# EasyEDA schematic loubar circuit.json
TITLE: Sheet_1; REV: 1.0; Date: 2024-02-27; Sheet: 1/1; Company: Your Company
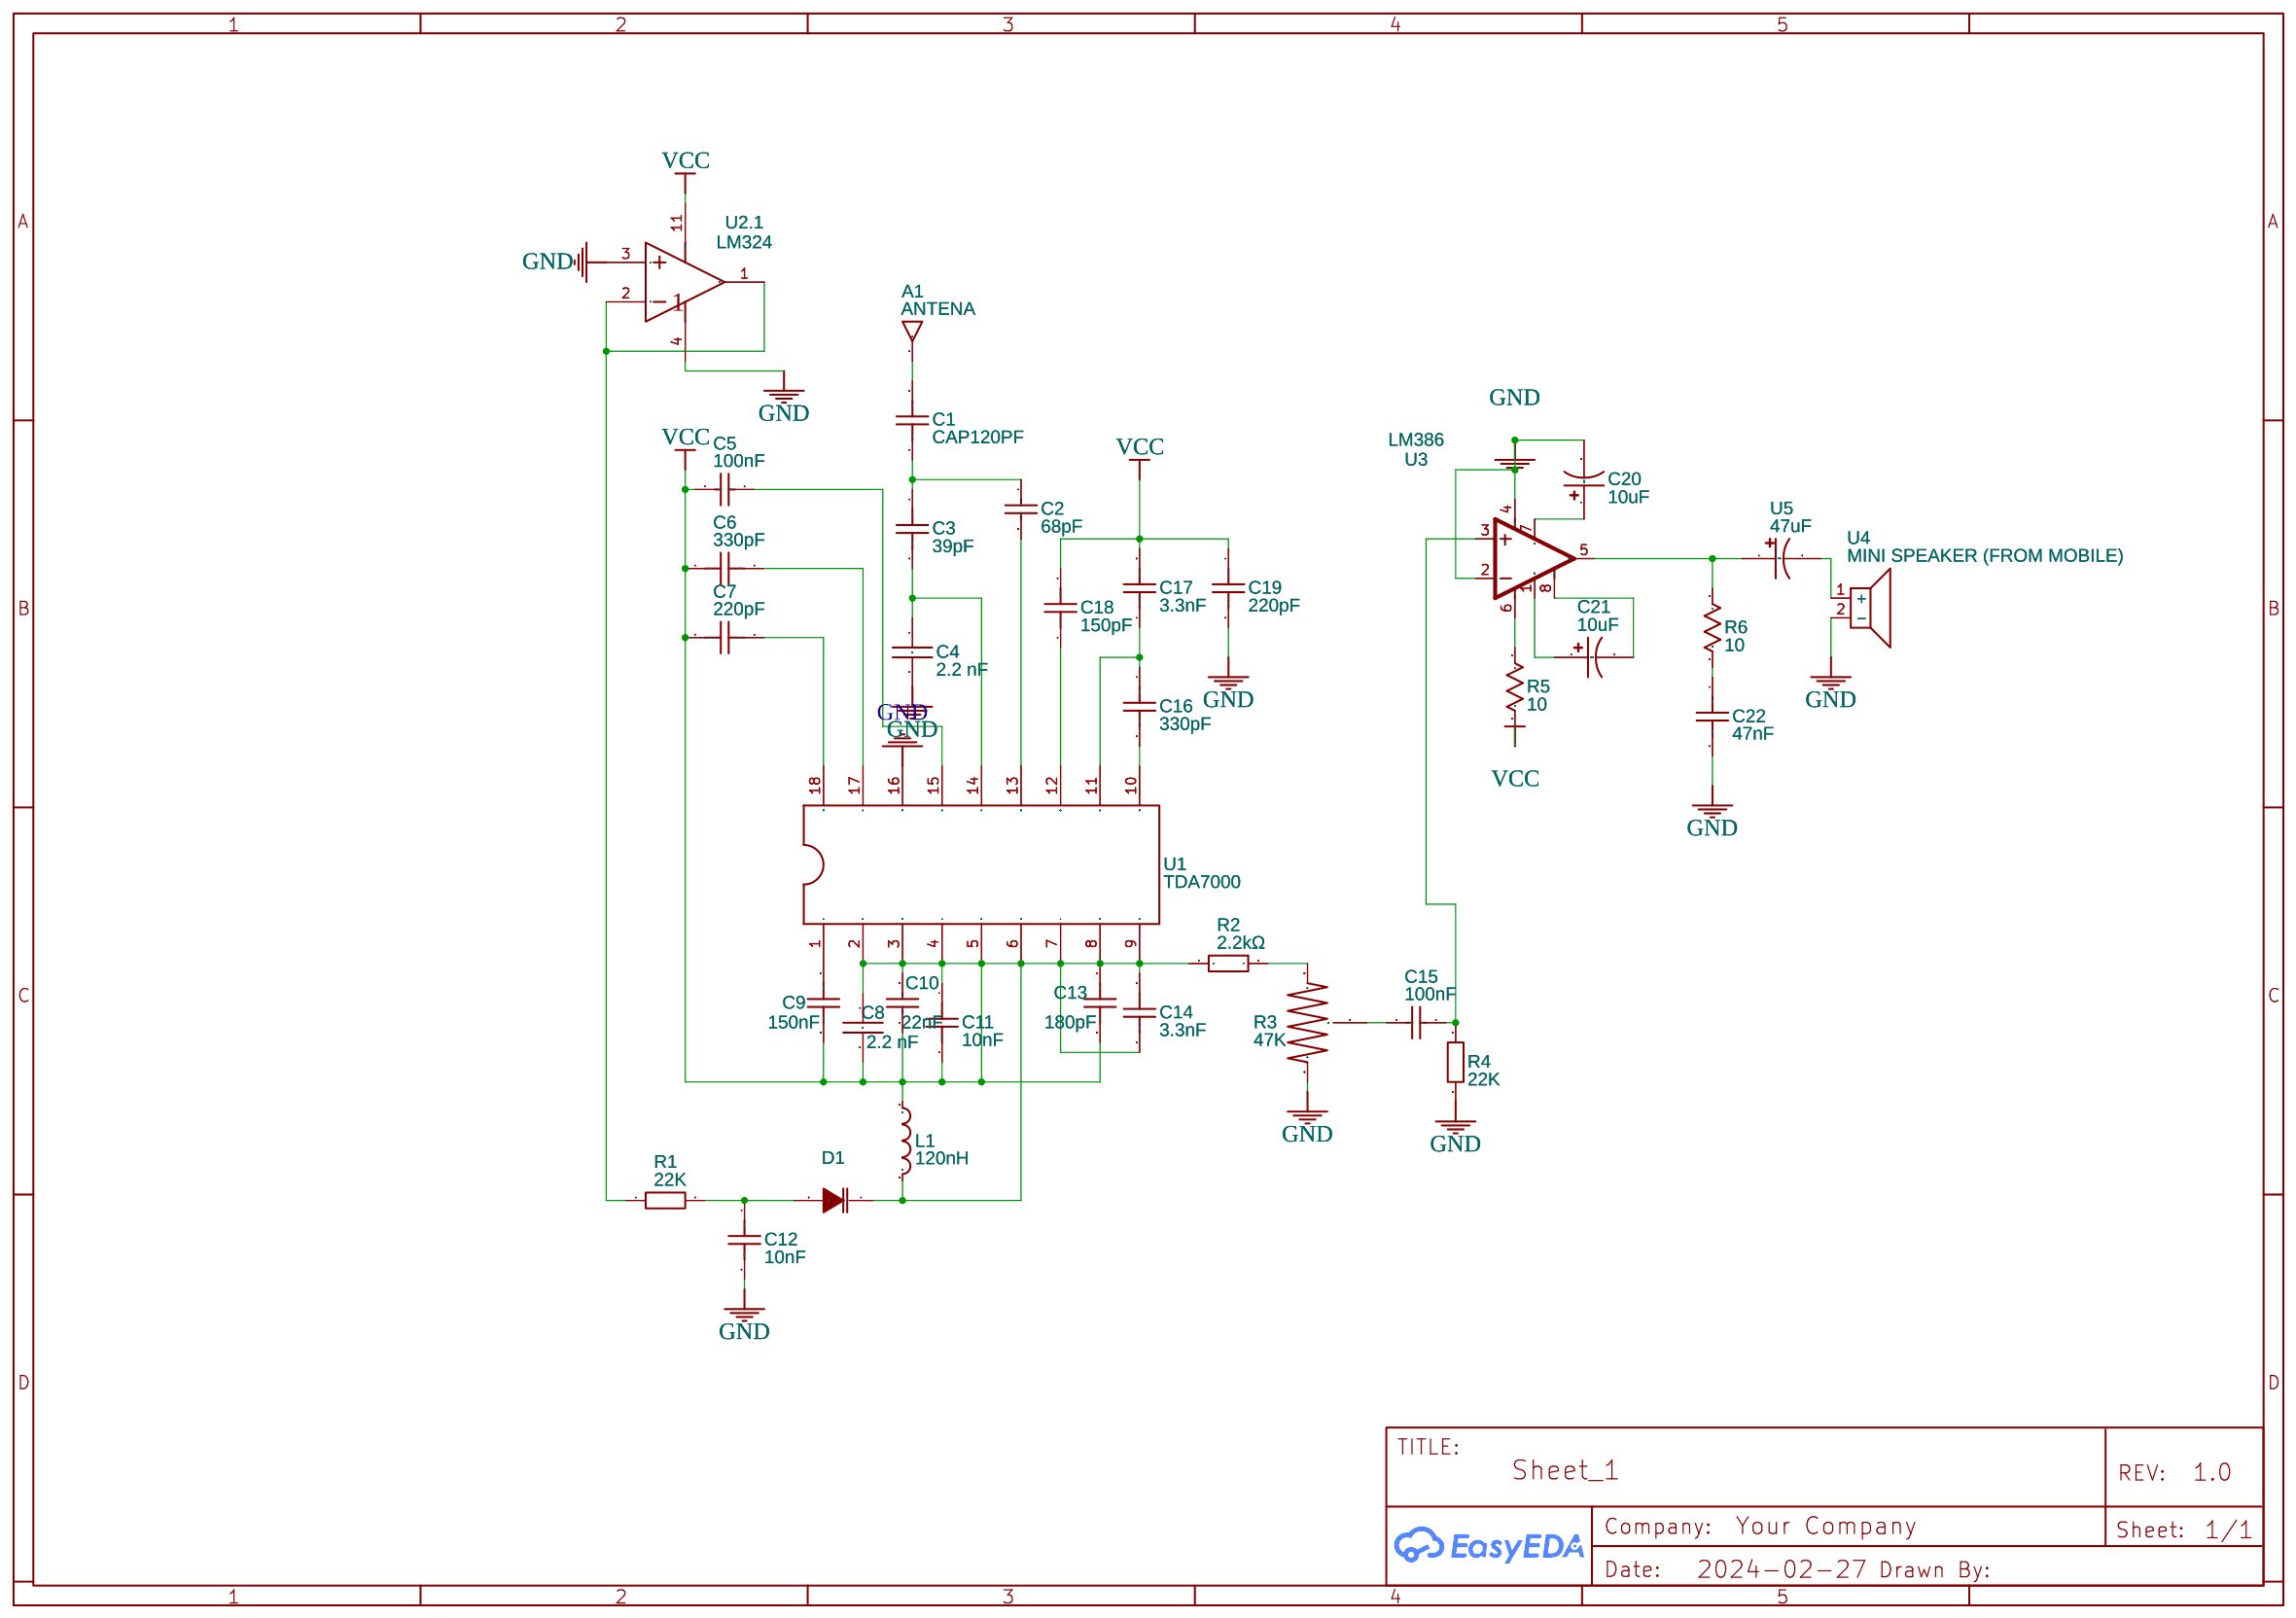
[diagram p0: schematic sheet]

## Parts
A1  ANTENA  [ANTENA]
C1  CAP120PF  [TAPEPATH_CAP120PF]
C2  68pF  [CAPACITOR 68PF CERAMIC]
C3  39pF  [CAP-TH_L4.8-W3.2-P5.08-D0.5]
C4  2.2 nF  [CAPACITOR 2.2 NF]
C5  100nF  [CAP-TH_L4.9-W3.7-P5.08-D0.5]
C6  330pF  [CAP-TH_L7.0-W4.5-P10.00-D1.0]
C7  220pF  [CAP-TH_L6.0-W3.5-P7.50-D1.0]
C8  2.2 nF  [CAPACITOR 2.2 NF]
C9  150nF  [CAP-TH_L12.0-W7.5-P10.0-D0.6]
C10  22nF  [CAP-TH_L7.0-W3.5-P5.00-D0.6]
C11  10nF  [CAP-DS-4.2*3.8]
C12  10nF  [CAP-DS-4.2*3.8]
C13  180pF  [CAP-TH_L3.8-W2.5-P2.54-D0.5]
C14  3.3nF  [CAP-DS-4.2*3.8]
C15  100nF  [CAP-TH_L4.9-W3.7-P5.08-D0.5]
C16  330pF  [CAP-TH_L7.0-W4.5-P10.00-D1.0]
C17  3.3nF  [CAP-DS-4.2*3.8]
C18  150pF  [CAP-TH_L6.0-W4.0-P10.00-D0.7]
C19  220pF  [CAP-TH_L6.0-W3.5-P7.50-D1.0]
C20  10uF  [CAP-TH_BD8.0-P3.50-D0.6-FD]
C21  10uF  [CAP-TH_BD8.0-P3.50-D0.6-FD]
C22  47nF  [CAP-TH_L11.5-W7.0-P10.00-D1.2]
D1  BB105 VARICAP  [BB_VARICAP]
L1  120nH  [120NH_SQUARE_PCB_COIL]
R1  22K  [RESISTOR 1/4 WATT 22K OHM]
R2  2.2kΩ  [RES-TH_BD2.3-L6.5-P10.50-D0.5]
R3  47K  [POTENTIOMETER B47K]
R4  22K  [RESISTOR 1/4 WATT 22K OHM]
R5  10  [PKG-0.25W RESISTOR]
R6  10  [PKG-0.25W RESISTOR]
U1  TDA7000  [TDA7000]
U2  LM324  [SOIC-14_L8.7-W3.9-P1.27-LS6.0-BL]  (section 1)
U3  LM386  [DIP08]
U4  MINI SPEAKER (FROM MOBILE)  [SPEAKERPCB_TEST]
U5  47uF  [CAP-TH_BD8.0-P3.50-D0.6-FD_1]

## Library data of the parts
A1 = ANTENA: Contributor: marciofaccin
C1 = TAPEPATH_CAP120PF: Contributor: olesiaserba
C2 = 68pF: Contributor: lincolngerken
C3 = CC4-0805-CG -50V-39pF-J: Contributor: LCSC; Supplier: LCSC; Supplier Part: C123161; Manufacturer: TORCH(火炬); Manufacturer Part: CC4-0805-CG-50V-39pF-J; JLCPCB Part Class: Extended Part
C4 C8 = 2.2 nF: Manufacturer: KEMET; Manufacturer Part: R413F12200000M; Supplier: Mouser; Supplier Part: 80-R413F12200000M; link: https://www.mouser.com/ProductDetail/80-R413F12200000M; Contributor: PanamaHitek
C5 C15 = 100nF: Supplier: LCSC; Manufacturer: null; Manufacturer Part: 0.1UF(104) +-20% 63v; Supplier Part: C19355; JLCPCB Part Class: Extended Part
C6 C16 = A08B1D331KN0B0S0N0: Contributor: LCSC; Supplier: LCSC; Supplier Part: C249243; Manufacturer: STE(松田); JLCPCB Part Class: Extended Part
C7 C19 = A07B1D221KN0B0S0N0: Contributor: LCSC; Supplier: LCSC; Supplier Part: C249242; Manufacturer: STE(松田); JLCPCB Part Class: Extended Part
C9 = B22J154JN190120120075EOZ: Contributor: lcsc; Supplier: LCSC; Supplier Part: C2893258; Manufacturer: STE(松田); JLCPCB Part Class: Extended Part
C10 = 22NF: Supplier: LCSC; Manufacturer: ReliaPro; Manufacturer Part: Calibration capacitor22NF（223） 100V 5%; Supplier Part: C26612
C11 C12 = 10nF: Tolerance: ±10%; Supplier Part: C8033; Supplier: LCSC; Manufacturer: LCSC; Manufacturer Part: CT4-0805B103K500
C13 = C315C181KAG5TA: Contributor: LCSC; Supplier: LCSC; Supplier Part: C1628572; Manufacturer: KEMET(基美); JLCPCB Part Class: Extended Part
C14 C17 = 3.3nF: Tolerance: ±20%; Supplier Part: C3761; Supplier: LCSC; Manufacturer: ReliaPro; Manufacturer Part: CT4-0805Y332 M500
C18 = A07B1D151KN0B0S0N0: Contributor: LCSC; Supplier: LCSC; Supplier Part: C366696; Manufacturer: STE(松田); JLCPCB Part Class: Extended Part
C20 C21 = 01EC0004SHG10UF250V: Contributor: LCSC; Supplier: LCSC; Supplier Part: C503209; Manufacturer: KNSCHA(科尼盛); Manufacturer Part: 01EC0004SHG10uF250V; JLCPCB Part Class: Extended Part
C22 = AF473K2G109L270D9R: Contributor: LCSC; Supplier: LCSC; Supplier Part: C430859; Manufacturer: Carli(凯励); JLCPCB Part Class: Extended Part
D1 = BB105 VARICAP: Manufacturer Part: BB105; Contributor: hg5cfj
L1 = 120nH: Contributor: Harry64
R1 R4 = 22K: Contributor: Hendriyana
R2 = CF1/4W-2.2KΩ±5% T52: Contributor: LCSC; Supplier: LCSC; Supplier Part: C120063; Manufacturer: CCO(千志电子); Manufacturer Part: CF1/4W-2.2KΩ±5% T; JLCPCB Part Class: Extended Part
R3 = 47K: Contributor: rhgoribeiro; sourceId: lGqkCUO6o
R5 R6 = 10: Power: 1/4W; Tolerance: ±5%; Supplier Part: 9339116; Supplier: Element14; Manufacturer: MULTICOMP; Manufacturer Part: MCF 0.25W 120R; Link: http://www.farnell.com/datasheets/1716725.pdf?_ga=2.130313612.2023696496.1506695686-238689616.1505921947&_gac=1.45287312.1506011718.EAIaIQobChMI57GX6tq21gIVTzobCh2WXgT2EAAYASAAEgKn9_D_BwE; Contributor: Prof. Ing. F. Scordino
U1 = TDA7000: Contributor: ivokovacic
U2 = LM324: subpart_no: 1; Supplier: LCSC; Supplier Part: C351427; Manufacturer: PUOLOP(迪浦); JLCPCB Part Class: Extended Part
U3 = LM386: Contributor: SparkFun
U4 = MINI SPEAKER (FROM MOBILE): Manufacturer Part: Speaker; Contributor: ludfilhadi
U5 = 100PX47MEFC8X11.5: Contributor: lcsc; Supplier: LCSC; Supplier Part: C473212; Manufacturer: rubycon(红宝石); JLCPCB Part Class: Extended Part

## Nets
GND: C4.2 C12.2 C19.2 C20.2 C22.2 R3.R2 R4.2 U1.16 U2.3(IN+) U2.4(V+) U3.2(-IN) U3.4(V-) U4.2(-)
VCC: C5.1 C6.1 C7.1 C8.1 C8.2 C9.2 C10.1 C10.2 C11.1 C11.2 C13.1 C13.2 C14.1 C14.2 C17.2 C18.2 C19.1 D1.1(K) L1.1 L1.2 R2.1 R5.2 U1.2 U1.3 U1.4 U1.5 U1.6 U1.7 U1.8 U1.9 U2.11(V-)
Net-(A1-1): A1.1 C1.2
Net-(C1-1): C1.1 C2.1 C3.1
Net-(C2-2): C2.2 U1.13
Net-(C3-2): C3.2 C4.1 U1.14
Net-(C5-2): C5.2 U1.15
Net-(C6-2): C6.2 U1.17
Net-(C7-2): C7.2 U1.18
Net-(C9-1): C9.1 U1.1
Net-(C12-1): C12.1 D1.2(A) R1.2
Net-(C15-1): C15.1 R3.VAR
Net-(C15-2): C15.2 R4.1 U3.3(+IN)
Net-(C16-1): C16.1 C17.1 U1.11
Net-(C16-2): C16.2 U1.10
Net-(C18-1): C18.1 U1.12
Net-(C20-1): C20.1 U3.7(BP)
Net-(C21-1): C21.1 U3.1(GAIN)
Net-(C21-2): C21.2 U3.8(GAIN)
Net-(C22-1): C22.1 R6.2
Net-(R1-1): R1.1 U2.1(OUT) U2.2(IN-)
Net-(R2-2): R2.2 R3.R1
Net-(R5-1): R5.1 U3.6(V+)
Net-(R6-1): R6.1 U3.5(OUT) U5.1
Net-(U4-1): U4.1(+) U5.2
